# Altium schematic sheet main.SchDoc
size A3; PageSetup: Record=PageOptions|CenterHorizontal=True|CenterVertical=True|PrintScale=1.00|XCorrection=1.00|YCorrection=1.00|PrintKind=1|BorderSize=5000000|LeftOffset=0|BottomOffset=0|Orientation=2|PaperLength=1000|PaperWidth=1000|Scale=100|PaperSource=7|PrintQuality=-4|MediaType=1|DitherType=10|PaperKind=A3|PrintScaleMode=1
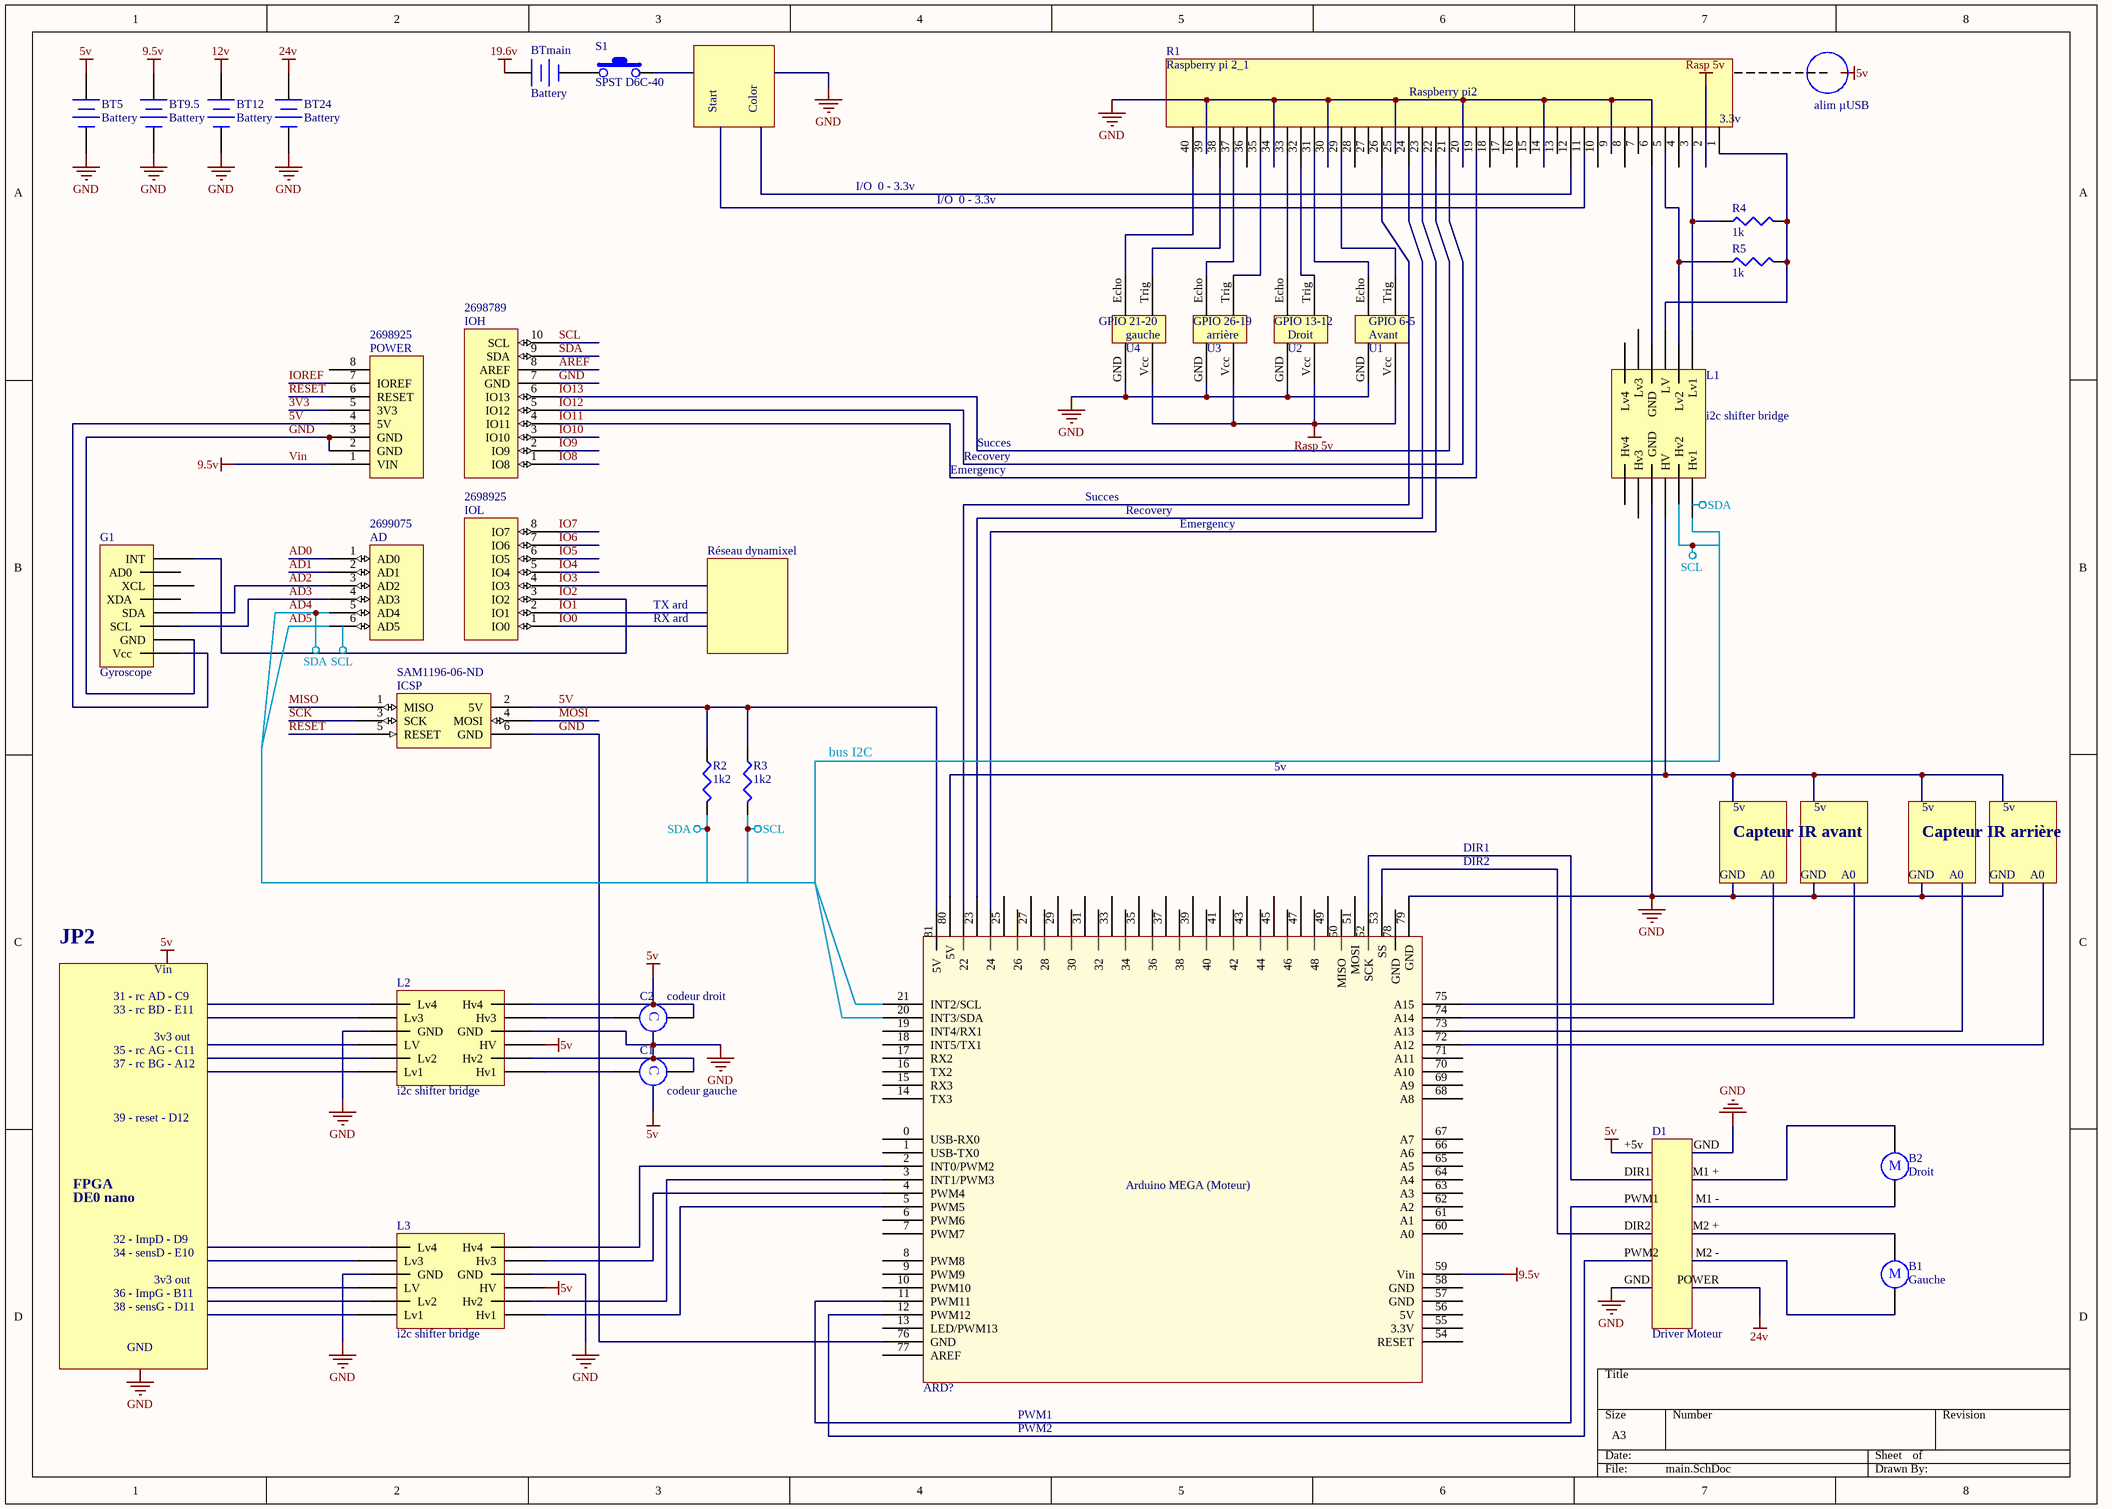
[diagram p0: main.SchDoc]

## Parts
AD  Supplier Part Number 4: 2699075  [Header 6x1 8.5mm]  (hidden comment: AD)
ARD?  Arduino MEGA (Moteur)  [Arduino]
B1  Gauche  [RB5-10.5]
B2  Droit  [RB5-10.5]
BT5  Battery  [BAT-2]
BT9.5  Battery  [BAT-2]
BT12  Battery  [BAT-2]
BT24  Battery  [BAT-2]
BTmain  Battery  [BAT-2]
C1  codeur gauche  [RB5-10.5]
C2  codeur droit  [RB5-10.5]
D1  Driver Moteur
G1  Gyroscope
ICSP  Supplier Part Number 5: SAM1196-06-ND  [ICSP]  (hidden comment: ICSP)
IOH  Supplier Part Number 3: 2698789  [Header 10x1 8.5mm]  (hidden comment: IOH)
IOL  Supplier Part Number 4: 2698925  [Header 8x1 8.5mm]  (hidden comment: IOL)
L1  i2c shifter bridge
L2  i2c shifter bridge
L3  i2c shifter bridge
POWER  Supplier Part Number 4: 2698925  [Header 8x1 8.5mm]  (hidden comment: POWER_UNO)
R1  Raspberry pi 2_1
R2  value 1k2  [AXIAL-0.4]  (hidden comment: Résistance)
R3  value 1k2  [AXIAL-0.4]  (hidden comment: Résistance)
R4  value 1k  [AXIAL-0.4]  (hidden comment: Résistance)
R5  value 1k  [AXIAL-0.4]  (hidden comment: Résistance)
S1  Type: SPST D6C-40  (hidden comment: Bouton Poussoir D6)
U1  Avant
U2  Droit
U3  arrière
U4  gauche

## Nets
5V: ARD?.81(5V) BT5.1(+) C2.1 D1.+5v G1.91(Vcc) ICSP.2(5V) L2.94(HV) L2.97(Hv4) L3.94(HV) POWER.4(5V) R2.1 R3.1
12v: BT12.1(+)
19.6v: BTmain.1(+)
24v: BT24.1(+) D1.POWER
AD4: AD.5(AD4) AD.6(AD5) IOH.9(SDA) R2.2  [also labelled AD5, SDA]
GND: ARD?.76(GND) ARD?.79(GND) BT5.2(-) BT9.5.2(-) BT12.2(-) BT24.2(-) C1.1 D1.GND G1.90(GND) ICSP.6(GND) IOH.7(GND) L1.95(GND) L2.93(Hv2) L2.95(GND) L2.101(GND) L3.95(GND) L3.101(GND) POWER.2(GND) POWER.3(GND) R1.9 R1.14 R1.20 R1.25 R1.30 R1.34 R1.39 U1.GND U2.GND U3.GND U4.GND
Rasp 5v: R1.2 U1.Vcc U2.Vcc U3.Vcc U4.Vcc
SCL: IOH.10(SCL) L1.92(Hv1) L1.93(Hv2) R3.2
Vin: ARD?.59(Vin) BT9.5.1(+) POWER.1(VIN)  [also labelled 9.5v]
3V3: POWER.5(3V3)
AD0: AD.1(AD0)
AD1: AD.2(AD1)
AD2: AD.3(AD2) G1.88(SDA)
AD3: AD.4(AD3) G1.89(SCL)
AREF: IOH.8(AREF)
IO0: IOL.1(IO0)
IO1: IOL.2(IO1)
IO2: G1.84(INT) IOL.3(IO2)
IO3: IOL.4(IO3)
IO4: IOL.5(IO4)
IO5: IOL.6(IO5)
IO6: IOL.7(IO6)
IO7: IOL.8(IO7)
IO8: IOH.1(IO8)
IO9: IOH.2(IO9)
IO10: IOH.3(IO10)
IO11: IOH.4(IO11) R1.19
IO12: IOH.5(IO12) R1.21
IO13: IOH.6(IO13) R1.22
IOREF: POWER.7(IOREF)
MISO: ICSP.1(MISO)
MOSI: ICSP.4(MOSI)
RESET: ICSP.5(RESET) POWER.6(RESET)
SCK: ICSP.3(SCK)
NetARD?_2: ARD?.2(INT0/PWM2) L3.97(Hv4)
NetARD?_3: ARD?.3(INT1/PWM3) L3.93(Hv2)
NetARD?_4: ARD?.4(PWM4) L3.96(Hv3)
NetARD?_5: ARD?.5(PWM5) L3.92(Hv1)
NetARD?_11: ARD?.11(PWM11) D1.PWM1
NetARD?_12: ARD?.12(PWM12) D1.PWM2
NetARD?_20: ARD?.20(INT3/SDA) ARD?.21(INT2/SCL)
NetARD?_22: ARD?.22 R1.26
NetARD?_23: ARD?.23 R1.24
NetARD?_24: ARD?.24 R1.23
NetARD?_52: ARD?.52(SCK) D1.DIR1
NetARD?_53: ARD?.53(SS) D1.DIR2
NetARD?_80: ARD?.80(5V) L1.94(HV)
NetB1_1: B1.1 D1.M2_+
NetB1_2: B1.2 D1.M2_-
NetB2_1: B2.1 D1.M1_+(M1+)
NetB2_2: B2.2 D1.M1_-
NetBTmain_2: BTmain.2(-) S1.1
NetC1_2: C1.2 L2.92(Hv1)
NetC2_2: C2.2 L2.96(Hv3)
NetL1_98: L1.98(Lv1) R1.3 R4.1
NetL1_99: L1.99(Lv2) R1.5 R5.1
NetL1_100: L1.100(LV) R1.1 R4.2 R5.2
NetL1_101: L1.101(GND) R1.6
NetR1_29: R1.29 U1.Trig
NetR1_31: R1.31 U1.Echo
NetR1_32: R1.32 U2.Trig
NetR1_33: R1.33 U2.Echo
NetR1_35: R1.35 U3.Trig
NetR1_37: R1.37 U3.Echo
NetR1_38: R1.38 U4.Trig
NetR1_40: R1.40 U4.Echo

Not connected (* = marked no-connect by the designer): ARD? 0(USB-RX0) 1(USB-TX0) 6(PWM6) 7(PWM7) 8(PWM8) 9(PWM9) 10(PWM10) 13(LED/PWM13) 14(TX3) 15(RX3) 16(TX2) 17(RX2) 18(INT5/TX1) 19(INT4/RX1) 25 26 27 28 29 30 31 32 33 34 35 36 37 38 39 40 41 42 43 44 45 46 47 48 49 50(MISO) 51(MOSI) 54(RESET) 55(3.3V) 56(5V) 57(GND) 58(GND) 60(A0) 61(A1) 62(A2) 63(A3) 64(A4) 65(A5) 66(A6) 67(A7) 68(A8) 69(A9) 70(A10) 71(A11) 72(A12) 73(A13) 74(A14) 75(A15) 77(AREF) 78(GND); G1 85(AD0) 86(XCL) 87(XDA); L1 96(Hv3) 97(Hv4) 102(Lv3) 103(Lv4); L2 98(Lv1) 99(Lv2) 100(LV) 102(Lv3) 103(Lv4); L3 98(Lv1) 99(Lv2) 100(LV) 102(Lv3) 103(Lv4); POWER 8; R1 4 7 8 10 11 12 13 15 16 17 18 27 28 36; S1 2

## Notes on the sheet
- Start
- Color
- alim µUSB
- (near R1) 3.3v
- I/O  0 - 3.3v
- (near U4) GPIO 21-20
- (near U3) GPIO 26-19
- (near U2) GPIO 13-12
- (near U1) GPIO 6-5
- Succes
- Emergency
- Recovery
- Réseau dynamixel
- RX ard
- TX ard
- bus I2C
- 5v
- DIR1
- Capteur IR avant
- Capteur IR arrière
- DIR2
- GND
- A0
- JP2
- Vin
- 35 - rc AG - C11
- 33 - rc BD - E11
- 31 - rc AD - C9
- 3v3 out
- 37 - rc BG - A12
- 39 - reset - D12
- FPGA
- DE0 nano
- 34 - sensD - E10
- 32 - ImpD - D9
- 38 - sensG - D11
- 36 - ImpG - B11
- PWM1
- PWM2
- Labels drawn without touching a wire or pin: 5v, GND, SDA
- (in symbol Motor) M
- (in symbol Raspberry pi 2_1) Raspberry pi2
- (in symbol Roue codeuse) C

## Library data of the parts
ARD? = Arduino MEGA
B1 B2 = Motor: Motor, General Kind; Published: 24-Mar-1999; LatestRevisionDate: 17-Jul-2002; LatestRevisionNote: Re-released for DXP Platform.; PackageReference: RB5-10.5; Publisher: Altium Limited; PackageDescription: Capacitor (Radial); 2 Leads
BT5 BT9.5 BT12 BT24 BTmain = Battery: Multicell Battery; Published: 24-Mar-1999; LatestRevisionDate: 17-Jul-2002; LatestRevisionNote: Re-released for DXP Platform.; PackageReference: BAT-2; Publisher: Altium Limited; PackageDescription: Battery; 2 Leads
C1 C2 = Roue codeuse: Motor, General Kind; Published: 24-Mar-1999; LatestRevisionDate: 17-Jul-2002; LatestRevisionNote: Re-released for DXP Platform.; PackageReference: RB5-10.5; Publisher: Altium Limited; PackageDescription: Capacitor (Radial); 2 Leads
L1-L3 = i2c shifter bridge: Bi-directionnel level shifter
R2-R5 = Résistance: Résistance standard; Designer: ECAM 2005; Type: Résistance standard
S1 = Bouton Poussoir D6: Bouton poussoir; Manufacturer: ITT CANON; Supplier: Farnell 151-141; Designer: ECAM 2004; Color: Rouge
U1-U4 = Ultrason
AD = AD: Supplier 1: Arrow; Supplier Part Number 1: 2699089; Supplier 2: Digi-Key; Supplier Part Number 2: SAM1198-06-ND; Supplier 3: Arrow; Supplier Part Number 3: 2699088; Supplier 4: Arrow
ICSP = ICSP: Supplier 1: Arrow; Supplier Part Number 1: 2699117; Supplier 2: Arrow; Supplier Part Number 2: 2699116; Supplier 3: Digi-Key; Supplier Part Number 3: SAM1185-06-ND; Supplier 4: Arrow; Supplier Part Number 4: 2699091; Supplier 5: Digi-Key
IOH = IOH: Supplier 1: Arrow; Supplier Part Number 1: 2698803S4475693N1004; Supplier 2: Digi-Key; Supplier Part Number 2: SAM1198-10-ND; Supplier 3: Arrow
IOL = IOL: Supplier 1: Digi-Key; Supplier Part Number 1: SAM1198-08-ND; Supplier 2: Arrow; Supplier Part Number 2: 2698939; Supplier 3: Arrow; Supplier Part Number 3: 2698940; Supplier 4: Arrow
POWER = POWER_UNO: Supplier 1: Digi-Key; Supplier Part Number 1: SAM1198-08-ND; Supplier 2: Arrow; Supplier Part Number 2: 2698939; Supplier 3: Arrow; Supplier Part Number 3: 2698940; Supplier 4: Arrow